# EAGLE design 7ch_op_amp_board_v41 (EAGLE 7.2.0)
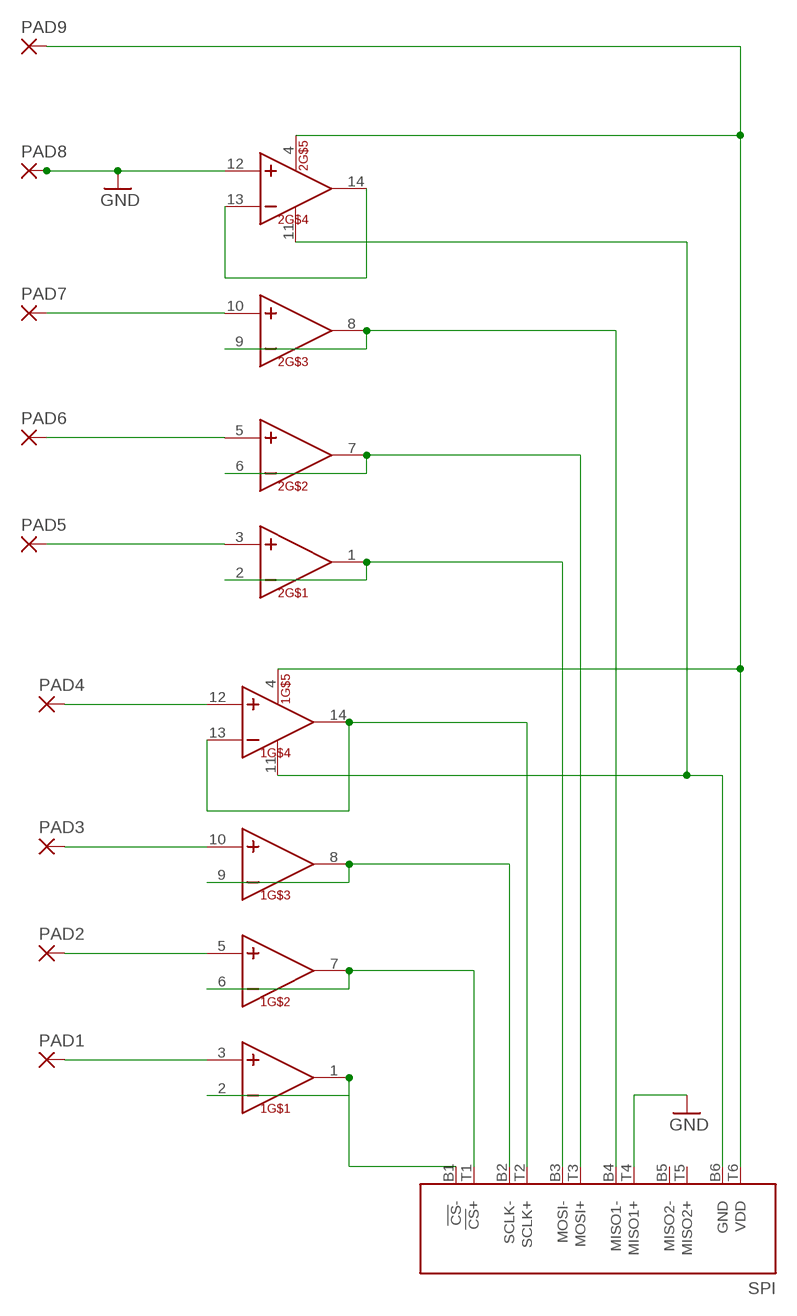
[diagram p0: schematic, sheet 1]

## Parts
1  TL074-TSSOP  [TSSOP14]
2  TL074-TSSOP  [TSSOP14]
PAD1  1,6/0,9  [1,6/0,9]
PAD2  1,6/0,9  [1,6/0,9]
PAD3  1,6/0,9  [1,6/0,9]
PAD4  1,6/0,9  [1,6/0,9]
PAD5  1,6/0,9  [1,6/0,9]
PAD6  1,6/0,9  [1,6/0,9]
PAD7  1,6/0,9  [1,6/0,9]
PAD8  1,6/0,9  [1,6/0,9]
PAD9  1,6/0,9  [1,6/0,9]
SPI  RHD2000-CABLE-AMP-SIDE  [OMNETICS_PZN-12-AA]

## Nets
GND: 2.12(IN+) PAD8.1(P) SPI.T4(MISO1+)
N$1: 1.1(OUT) 1.2(IN-) SPI.B1(!CS!-)
N$2: 1.6(IN-) 1.7(OUT) SPI.T1(!CS!+)
N$3: 2.1(OUT) 2.2(IN-) SPI.B3(MOSI-)
N$4: 2.6(IN-) 2.7(OUT) SPI.T3(MOSI+)
N$5: 2.8(OUT) 2.9(IN-) SPI.B4(MISO1-)
N$6: 2.13(IN-) 2.14(OUT)
N$7: 1.13(IN-) 1.14(OUT) SPI.T2(SCLK+)
N$8: 1.3(IN+) PAD1.1(P)
N$9: 1.8(OUT) 1.9(IN-) SPI.B2(SCLK-)
N$11: 1.5(IN+) PAD2.1(P)
N$12: 1.10(IN+) PAD3.1(P)
N$13: 1.12(IN+) PAD4.1(P)
N$21: 2.10(IN+) PAD7.1(P)
N$22: 2.5(IN+) PAD6.1(P)
N$23: 2.3(IN+) PAD5.1(P)
V+: 1.4(VCC+) 2.4(VCC+) PAD9.1(P) SPI.T6(VDD)
V-: 1.11(VCC-) 2.11(VCC-) SPI.B6(GND)
Unconnected: SPI.B5(MISO2-) SPI.T5(MISO2+)

## Library data of the parts
1 2 = kjbrown:TL074-TSSOP
PAD1-PAD9 = wirepad:1,6/0,9: THROUGH-HOLE PAD
SPI = RHD2000:RHD2000-CABLE-AMP-SIDE

## Board
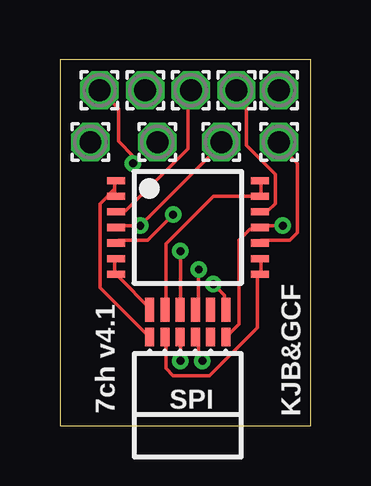
[diagram p1: board, top side]
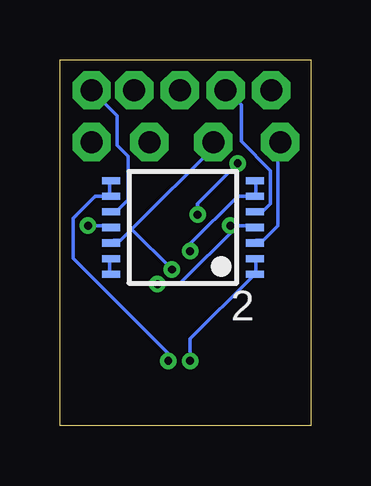
[diagram p2: board, bottom side, seen from below]

Size 10.46 x 15.23 mm. Coordinates in mm from the lower left corner, seen from the top.
Outline: 0,0 10.46,0 10.46,15.23 0,15.23 0,0
Copper layers (1*16): Top 0.0356mm / dielectric 1.5011mm / Bottom 0.0356mm
Design rules "LaenPCBOrder": minimum track width 6mil, minimum drill 13mil, track to track 6mil, track to pad 6mil, pad to pad 6mil, via to via 6mil, smd to smd 6mil, copper to edge 15mil, drill to drill 6mil, minimum pad ring 7mil, minimum via ring 7mil, stop-mask expansion 3mil, vias tented up to drill 0mil, thermal gap 10mil

### Footprints (pad centres in the part's own frame; a part is rotated, then mirrored left to right if it is on the bottom)
TSSOP14 = smd 0.3 x 0.75: 1 -1.95,-3; 2 -1.3,-3; 3 -0.65,-3; 4 0,-3; 5 0.65,-3; 6 1.3,-3; 7 1.95,-3; 8 1.95,3; 9 1.3,3; 10 0.65,3; 11 0,3; 12 -0.65,3; 13 -1.3,3; 14 -1.95,3
1,6/0,9 = drill 0.914 pad 1.6 octagon: 1 0,0
OMNETICS_PZN-12-AA = smd 0.381 x 0.762: B1 1.587,-1.016; B2 0.953,-1.016; B3 0.318,-1.016; B4 -0.318,-1.016; B5 -0.953,-1.016; B6 -1.587,-1.016 | smd 0.381 x 1.016: T1 1.587,-2.159; T2 0.953,-2.159; T3 0.318,-2.159; T4 -0.318,-2.159; T5 -0.953,-2.159; T6 -1.587,-2.159

### Placement (x,y rotation side)
1  5.33,8.25 270 top
2  5.33,8.25 90 bottom
PAD1  5.46,13.97 0 top
PAD2  1.65,13.97 0 top
PAD3  9.14,11.81 0 top
PAD4  7.37,13.97 0 top
PAD5  1.27,11.81 0 top
PAD6  3.56,13.97 0 top
PAD7  9.14,13.97 0 top
PAD8  4.06,11.81 0 top
PAD9  6.73,11.81 0 top
SPI  5.33,2.67 180 top

### Tracks (layer width: path | path; a pad name or v marks a point on that pad's centre or on a via)
GND  (via drill 0.33)
  Top 0.152: v5.79,6.5 5.79,4.83 SPI.T4
  Bottom 0.152: 7.47,8.18 3.96,11.68 PAD8.1 | 7.47,8.18 7.92,7.72 8.23,7.72 2.12 | 7.47,8.18 v5.79,6.5
N$1
  Top 0.152: 2.29,9.86 2.29,10.16 1.1 | 2.29,9.86 2.29,9.7 1.2 | 2.29,9.86 1.68,9.25 1.68,5.74 3.66,3.76 SPI.B1
N$2
  Top 0.152: 1.6 2.29,6.81 2.29,6.35 1.7 2.44,6.2 3.81,4.83 SPI.T1
N$3  (via drill 0.33)
  Top 0.152: v5.03,2.69 5.03,3.61 SPI.B3
  Bottom 0.152: 2.2 2.29,6.81 2.29,6.35 2.1 2.44,6.2 5.03,3.61 v5.03,2.69
N$4  (via drill 0.33)
  Top 0.152: v5.03,7.26 SPI.T3
  Bottom 0.152: 2.7 2.29,10.16 2.29,9.7 2.6 2.44,9.55 3.05,9.55 5.03,7.57 v5.03,7.26
N$5  (via drill 0.33)
  Top 0.152: v5.94,2.69 5.79,2.85 5.79,3.61 SPI.B4
  Bottom 0.152: 2.8 8.38,10.16 8.38,9.7 2.9 8.38,9.55 8.99,9.55 9.91,8.64 9.91,6.96 5.94,3 v5.94,2.69
N$6
  Bottom 0.152: 2.14 8.38,6.35 8.38,6.81 2.13
N$7
  Top 0.152: 1.14 8.38,10.16 8.38,9.7 1.13 8.23,9.55 6.4,9.55 4.42,7.57 4.42,4.83 SPI.T2
N$8
  Top 0.152: 1.3 2.44,8.94 2.74,8.94 5.33,11.53 5.33,13.97 PAD1.1
N$9
  Top 0.152: 1.9 8.38,6.81 8.38,6.35 1.8 8.23,6.2 8.23,4.06 6.25,2.08 4.72,2.08 4.42,2.39 4.42,3.61 SPI.B2
N$11  (via drill 0.33)
  Top 0.152: v4.72,8.79 3.66,7.72 2.44,7.72 1.5 | v3.05,10.92 3.05,11.23 2.44,11.84 2.44,13.21 1.68,13.97 PAD2.1
  Bottom 0.152: v4.72,8.79 4.72,9.25 v3.05,10.92
N$12
  Top 0.152: 1.10 8.38,7.72 9.6,7.72 9.91,8.03 9.91,10.92 9.14,11.68 PAD3.1
N$13
  Top 0.152: 1.12 8.38,8.94 8.69,8.94 8.99,9.25 8.99,10.46 7.77,11.68 7.77,13.66 7.47,13.97 PAD4.1
N$21
  Bottom 0.152: PAD7.1 8.08,12.9 8.08,11.68 7.62,11.23 7.62,9.4 8.08,8.94 8.23,8.94 2.10
N$22
  Bottom 0.152: 2.5 2.29,8.94 1.98,8.94 1.68,9.25 1.68,10.62 2.9,11.84 2.9,13.36 3.5,13.97 PAD6.1
N$23
  Bottom 0.152: 2.3 2.29,7.72 1.98,7.72 1.37,8.33 1.37,11.68 PAD5.1
V+  (via drill 0.33)
  Top 0.152: 2.4 2.44,8.33 v3.35,8.33 6.71,11.68 PAD9.1 | v6.4,5.89 6.86,5.44 6.86,4.83 SPI.T6
  Bottom 0.152: 3.05,8.33 2.44,8.33 2.4 | v6.4,5.89 5.49,5.89 3.05,8.33 | 3.05,8.33 v3.35,8.33
V-  (via drill 0.33)
  Top 0.152: SPI.B6 7.01,3.76 7.47,4.22 7.47,7.72 7.92,8.18 8.23,8.18 2.11 8.38,8.33 v9.3,8.33
  Bottom 0.152: v9.3,8.33 8.38,8.33 2.11

### Text on the board
_tsilk: 7ch v4.1 | SPI | KJB&GCF